# Altium schematic sheet arm_power.SchDoc
size A4
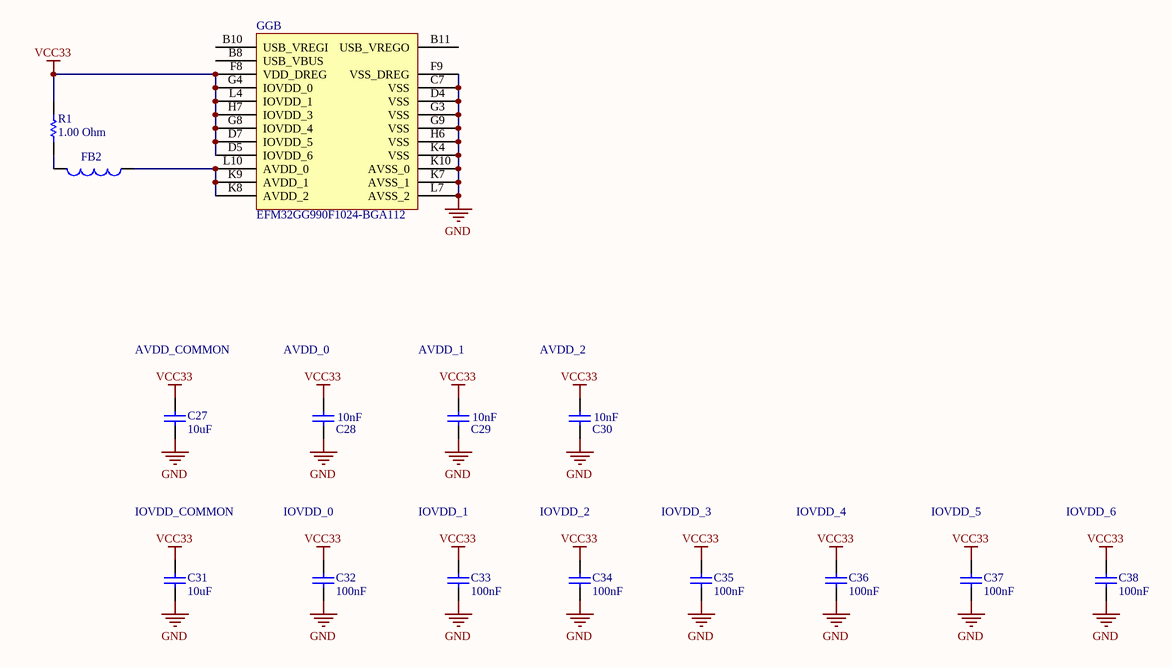
[diagram p0: arm_power.SchDoc]

## Parts
C27  10uF  [CAPC0805(2012)145_N]
C28  10nF  [CAPC0805(2012)75_N]
C29  10nF  [CAPC0805(2012)75_N]
C30  10nF  [CAPC0805(2012)75_N]
C31  10uF  [CAPC0805(2012)145_N]
C32  100nF  [CAPC0805(2012)100_M]
C33  100nF  [CAPC0805(2012)100_M]
C34  100nF  [CAPC0805(2012)100_M]
C35  100nF  [CAPC0805(2012)100_M]
C36  100nF  [CAPC0805(2012)100_M]
C37  100nF  [CAPC0805(2012)100_M]
C38  100nF  [CAPC0805(2012)100_M]
FB2  BLM21B102S or similar  [RESC3216N]  (value not drawn)
GG  EFM32GG990F1024-BGA112  [ENMR-BGA112]  (part B of 2)
R1  1.00 Ohm  [RESC0805(2012)_L]

## Nets
GND: C27.1 C28.1 C29.1 C30.1 C31.1 C32.1 C33.1 C34.1 C35.1 C36.1 C37.1 C38.1 GG.C7(VSS) GG.D4(VSS) GG.F9(VSS_DREG) GG.G3(VSS) GG.G9(VSS) GG.H6(VSS) GG.K4(VSS) GG.K7(AVSS_1) GG.K10(AVSS_0) GG.L7(AVSS_2)
VCC33: C27.2 C28.2 C29.2 C30.2 C31.2 C32.2 C33.2 C34.2 C35.2 C36.2 C37.2 C38.2 GG.D5(IOVDD_6) GG.D7(IOVDD_5) GG.F8(VDD_DREG) GG.G4(IOVDD_0) GG.G8(IOVDD_4) GG.H7(IOVDD_3) GG.L4(IOVDD_1) R1.2
NetFB2_1: FB2.1 GG.K8(AVDD_2) GG.K9(AVDD_1) GG.L10(AVDD_0)
NetFB2_2: FB2.2 R1.1

Not connected (* = marked no-connect by the designer): GG B8(USB_VBUS) B10(USB_VREGI) B11(USB_VREGO)

## Notes on the sheet
- AVDD_COMMON
- AVDD_0
- AVDD_1
- AVDD_2
- IOVDD_COMMON
- IOVDD_0
- IOVDD_1
- IOVDD_2
- IOVDD_3
- IOVDD_4
- IOVDD_5
- IOVDD_6

## Library data of the parts
C27 C31 = CMP-1036-04932-1: CAP 10uF 25V ±10% 0805 (2012 Metric) Thickness 1.45mm SMD; Case-EIA: 0805; Case-Metric: 2012; Technology: SMT; Value: 10uF; Rated Voltage: 25 V; Max Thickness: 1.45 mm; Tolerance: ±10%
C28-C30 = CMP-1036-03842-1: CAP 10nF 50V ±10% 0805 (2012 Metric) Thickness 0.75mm SMD; Case-Metric: 2012; Case-EIA: 0805; Value: 10nF; Max Thickness: 0.75 mm; Rated Voltage: 50 V; Tolerance: ±10%; Technology: SMT
C32-C38 = CMP-1036-04420-1: CAP 100nF 50V ±10% 0805 (2012 Metric) Thickness 1mm SMD; Case-EIA: 0805; Case-Metric: 2012; Rated Voltage: 50 V; Value: 100nF; Tolerance: ±10%; Max Thickness: 1 mm; Technology: SMT
FB2 = Inductor: Code_IEC: 1005; Value: 10mH; Published: 8-Jun-2000; LatestRevisionDate: 29-May-2009; LatestRevisionNote: IPC-7351 Footprint Added.; PackageReference: 0402-A; Publisher: Altium Limited; PackageDescription: Chip Inductor; Code_JEITA: 0402
GG = EFM32GG990F1024-BGA112: EFM32 Giant Gecko, M3 ARM Cortex CPU, 1024 KB Flash, 128 KB RAM, 1.85 - 3.8 V Supply, 48 MHz Max Speed, -40 to 85 degC, 112-Pin BGA, RoHS Compliant; Flash (KB): 1024; GPIO: 87; LCD: 8x34; LESENSE: Y; Max Speed (MHz): 48; OPAMPS: 3; RAM (KB): 128; DatasheetVersion: Rev 1.00; PackageVersion: Rev. 97SPP01315A_X03_06Jun11; PackageReference: BGA112; PackageDescription: 112-Pin Ball Grid Array, Body 10 x 10 mm, Pitch 0.8 mm; Supplier 1: Digi-Key; Supplier Part Number 1: 914-1051-2-ND; Supplier 2: Digi-Key; Supplier Part Number 2: 914-1051-1-ND; Supplier 3: Digi-Key; Supplier Part Number 3: 914-1051-6-ND; Supplier 4: Mouser; Supplier Part Number 4: 904-EFM32GG990F1024; ARM Cortex CPU: M3; Subcategory: EFM32 Giant Gecko; Supply Voltage (V): 1.85 - 3.8; USB: Y; Mounting Technology: Surface Mount; Generic Part Number: EFM32GG990; PartNumber: EFM32GG990F1024-BGA112; ComponentLink1Description: Manufacturer URL; ComponentLink1URL: http://www.energymicro.com/; ComponentLink2Description: Datasheet; ComponentLink2URL: http://cdn.energymicro.com/dl/devices/pdf/d0046_efm32gg990_datasheet.pdf; ComponentLink3Description: Package Specification; ComponentLink3URL: http://cdn.energymicro.com/dl/devices/pdf/d0007_efm32g290_datasheet.pdf
R1 = CMP-1013-00002-1: 1R 0.125W 5% 0805 (2012 Metric)  SMD; Case-EIA: 0805; Case-Metric: 2012; Power: 0.125 W; Tolerance: 5 %; Value: 1.00 Ohm; Technology: SMT